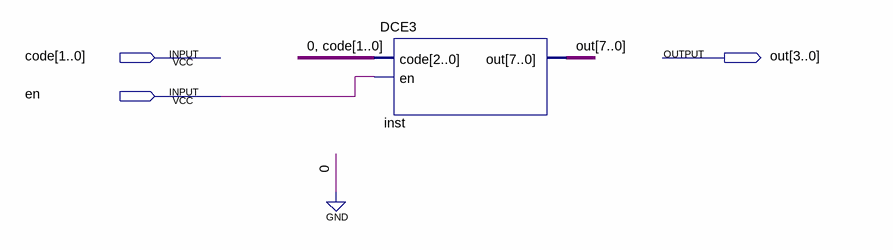
[diagram p0: schematic sheet]
// Quartus schematic DCE2.bdf as structural Verilog: 1 symbols, 3 pins
module DCE2 (
  input  [1:0] code,
  input  en,
  output [7:0] out
);

  DCE3 inst (.code({1'b0, code}), .en(en), .out(out));
endmodule
